# EAGLE design Radio Board Rev B (EAGLE 9.1.1)
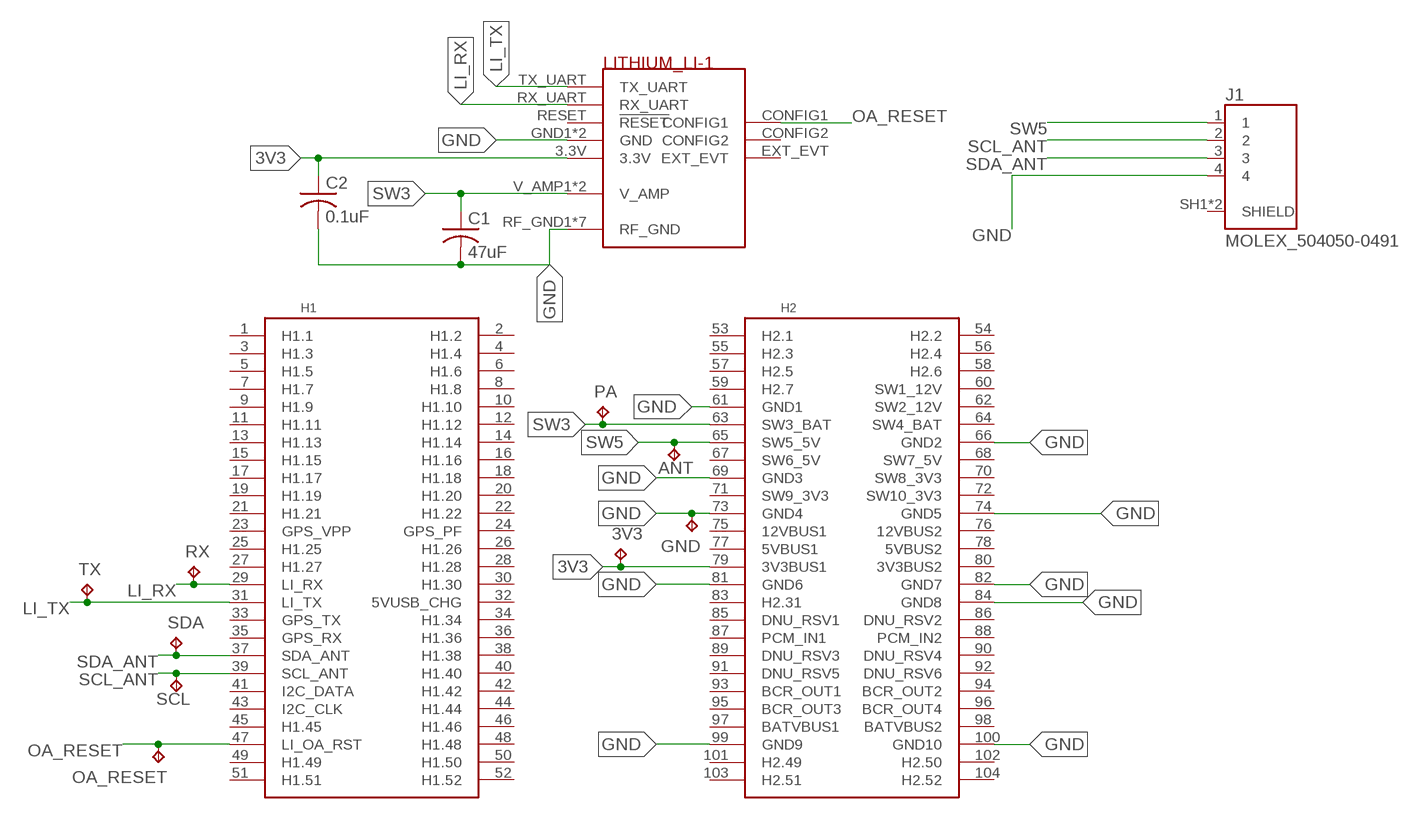
[diagram p0: schematic, sheet 1]

## Parts
3V3  TPTP10SQ  [TP10SQ]
ANT  TPTP10SQ  [TP10SQ]
C1  47uF  C-USC0805  [C0805]
C2  0.1uF  C-USC0805  [C0805]
GND  TPTP10SQ  [TP10SQ]
J1  MOLEX_504050-0491  [MOLEX_5040500491]
LI-1  LI-1  [LI-1]
OA_RESET  TPTP10SQ  [TP10SQ]
PA  TPTP10SQ  [TP10SQ]
RX  TPTP10SQ  [TP10SQ]
SCL  TPTP10SQ  [TP10SQ]
SDA  TPTP10SQ  [TP10SQ]
TX  TPTP10SQ  [TP10SQ]
U$1  PC104_NO_DIMENSION  [PC104_NO_DIMENSION]

## Nets
3V3: 3V3.TP C2.1 LI-1.3.3V U$1.79(3V3BUS1)
GND: C1.2 C2.2 GND.TP J1.4 LI-1.GND1(GND) LI-1.GND2(GND) LI-1.RF_GND1(RF_GND) LI-1.RF_GND2(RF_GND) LI-1.RF_GND3(RF_GND) LI-1.THERM1(RF_GND) LI-1.THERM2(RF_GND) LI-1.THERM3(RF_GND) LI-1.THERM4(RF_GND) U$1.61(GND1) U$1.66(GND2) U$1.69(GND3) U$1.73(GND4) U$1.74(GND5) U$1.81(GND6) U$1.82(GND7) U$1.84(GND8) U$1.99(GND9) U$1.100(GND10)
LI_RX: LI-1.RX_UART RX.TP U$1.29(LI_RX)
LI_TX: LI-1.TX_UART TX.TP U$1.31(LI_TX)
OA_RESET: LI-1.CONFIG1 OA_RESET.TP U$1.47(LI_OA_RST)
SCL_ANT: J1.2 SCL.TP U$1.39(SCL_ANT)
SDA_ANT: J1.3 SDA.TP U$1.37(SDA_ANT)
SW3: C1.1 LI-1.V_AMP1(V_AMP) LI-1.V_AMP2(V_AMP) PA.TP U$1.63(SW3_BAT)
SW5: ANT.TP J1.1 U$1.65(SW5_5V)
Unconnected: LI-1.CONFIG2 LI-1.EXT_EVT LI-1.RESET(!RESET) U$1.1(H1.1) U$1.2(H1.2) U$1.3(H1.3) U$1.4(H1.4) U$1.5(H1.5) U$1.6(H1.6) U$1.7(H1.7) U$1.8(H1.8) U$1.9(H1.9) U$1.10(H1.10) U$1.11(H1.11) U$1.12(H1.12) U$1.13(H1.13) U$1.14(H1.14) U$1.15(H1.15) U$1.16(H1.16) U$1.17(H1.17) U$1.18(H1.18) U$1.19(H1.19) U$1.20(H1.20) U$1.21(H1.21) U$1.22(H1.22) U$1.23(GPS_VPP) U$1.24(GPS_PF) U$1.25(H1.25) U$1.26(H1.26) U$1.27(H1.27) U$1.28(H1.28) U$1.30(H1.30) U$1.32(5VUSB_CHG) U$1.33(GPS_TX) U$1.34(H1.34) U$1.35(GPS_RX) U$1.36(H1.36) U$1.38(H1.38) U$1.40(H1.40) U$1.41(I2C_DATA) U$1.42(H1.42) U$1.43(I2C_CLK) U$1.44(H1.44) U$1.45(H1.45) U$1.46(H1.46) U$1.48(H1.48) U$1.49(H1.49) U$1.50(H1.50) U$1.51(H1.51) U$1.52(H1.52) U$1.53(H2.1) U$1.54(H2.2) U$1.55(H2.3) U$1.56(H2.4) U$1.57(H2.5) U$1.58(H2.6) U$1.59(H2.7) U$1.60(SW1_12V) U$1.62(SW2_12V) U$1.64(SW4_BAT) U$1.67(SW6_5V) U$1.68(SW7_5V) U$1.70(SW8_3V3) U$1.71(SW9_3V3) U$1.72(SW10_3V3) U$1.75(12VBUS1) U$1.76(12VBUS2) U$1.77(5VBUS1) U$1.78(5VBUS2) U$1.80(3V3BUS2) U$1.83(H2.31) U$1.85(DNU_RSV1) U$1.86(DNU_RSV2) U$1.87(PCM_IN1) U$1.88(PCM_IN2) U$1.89(DNU_RSV3) U$1.90(DNU_RSV4) U$1.91(DNU_RSV5) U$1.92(DNU_RSV6) U$1.93(BCR_OUT1) U$1.94(BCR_OUT2) U$1.95(BCR_OUT3) U$1.96(BCR_OUT4) U$1.97(BATVBUS1) U$1.98(BATVBUS2) U$1.101(H2.49) U$1.102(H2.50) U$1.103(H2.51) U$1.104(H2.52)

## Power pins joined to a net without a drawn wire
SHIELD: J1.SH1(SHIELD) J1.SH2(SHIELD)

## Library data of the parts
3V3 ANT GND OA_RESET PA RX SCL SDA TX = testpad:TP: Test pad
C1 C2 = resistor:C-US: CAPACITOR, American symbol
J1 = Molex 504050-0491:MOLEX_504050-0491: Conn Wire to Board HDR 4 POS 1.5mm Solder RA SMD Pico-Lock; AVAILABILITY: Good; DESCRIPTION: Conn Wire to Board HDR 4 POS 1.5mm Solder RA SMD Pico-Lock; MF: Molex; MP: 5040500491; PACKAGE: None
LI-1 = Cubesat:LI-1
U$1 = Cubesat:PC104_NO_DIMENSION

## Board
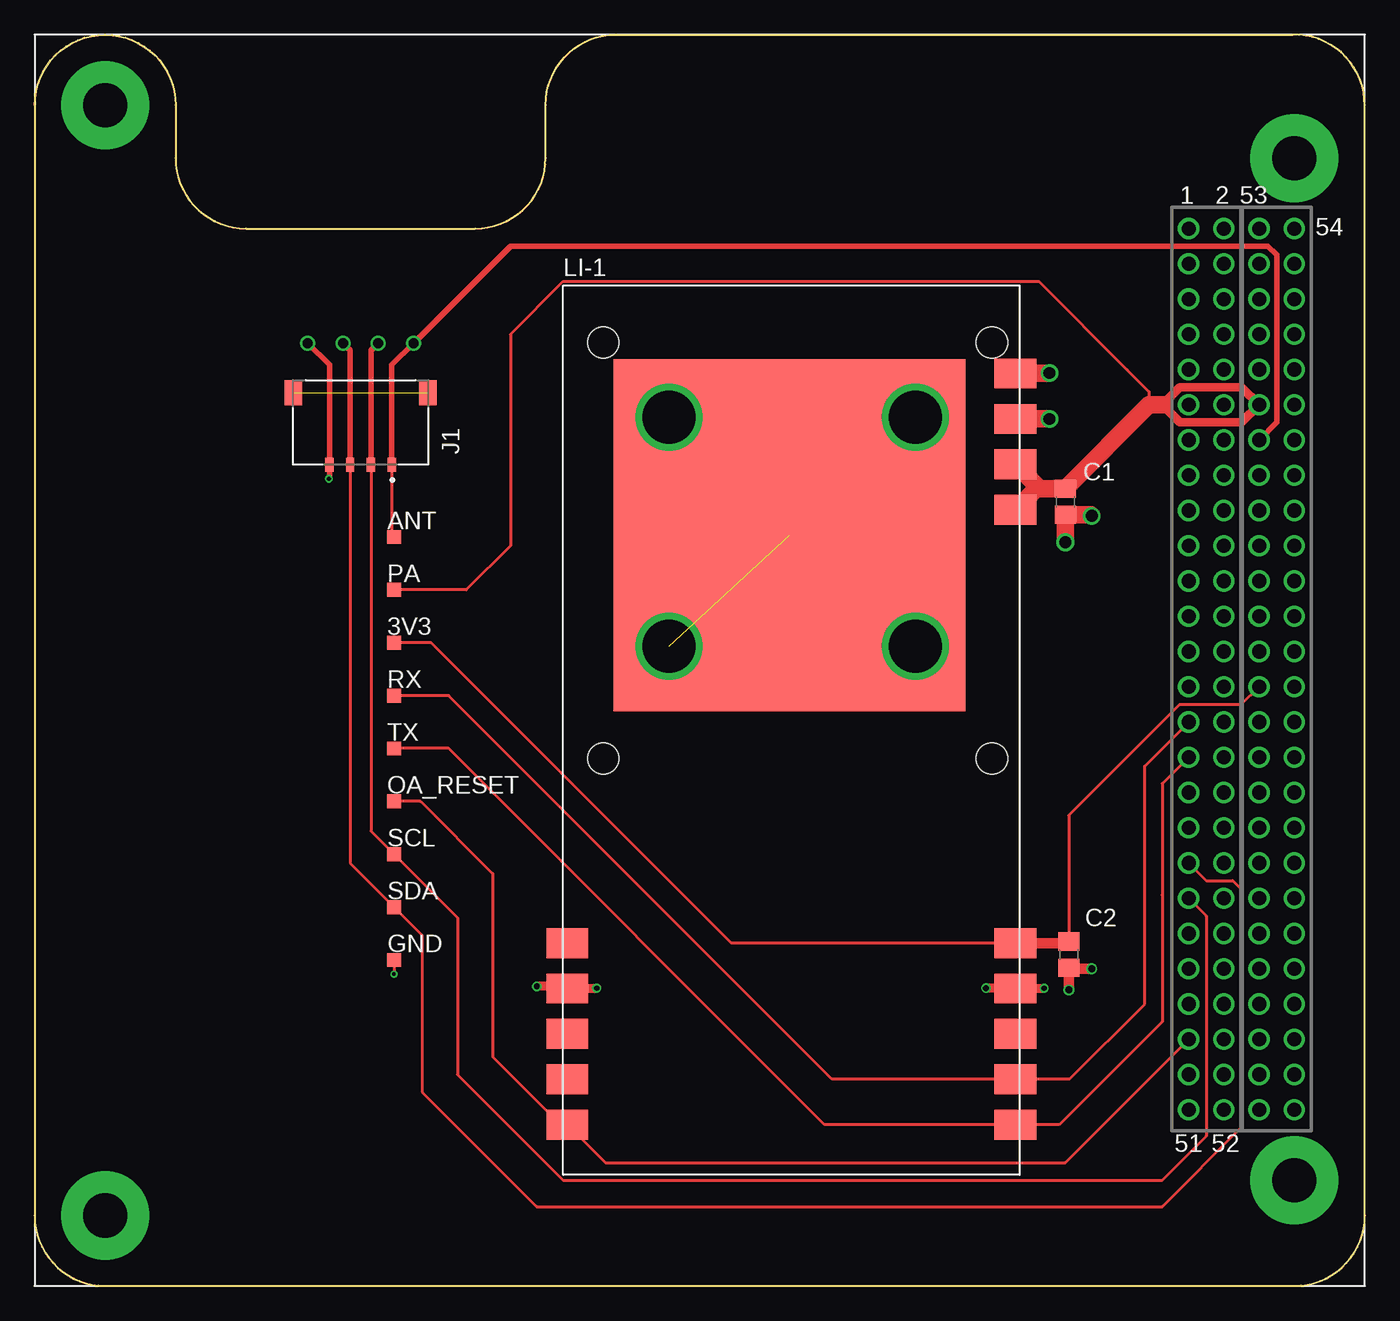
[diagram p1: board, top side]
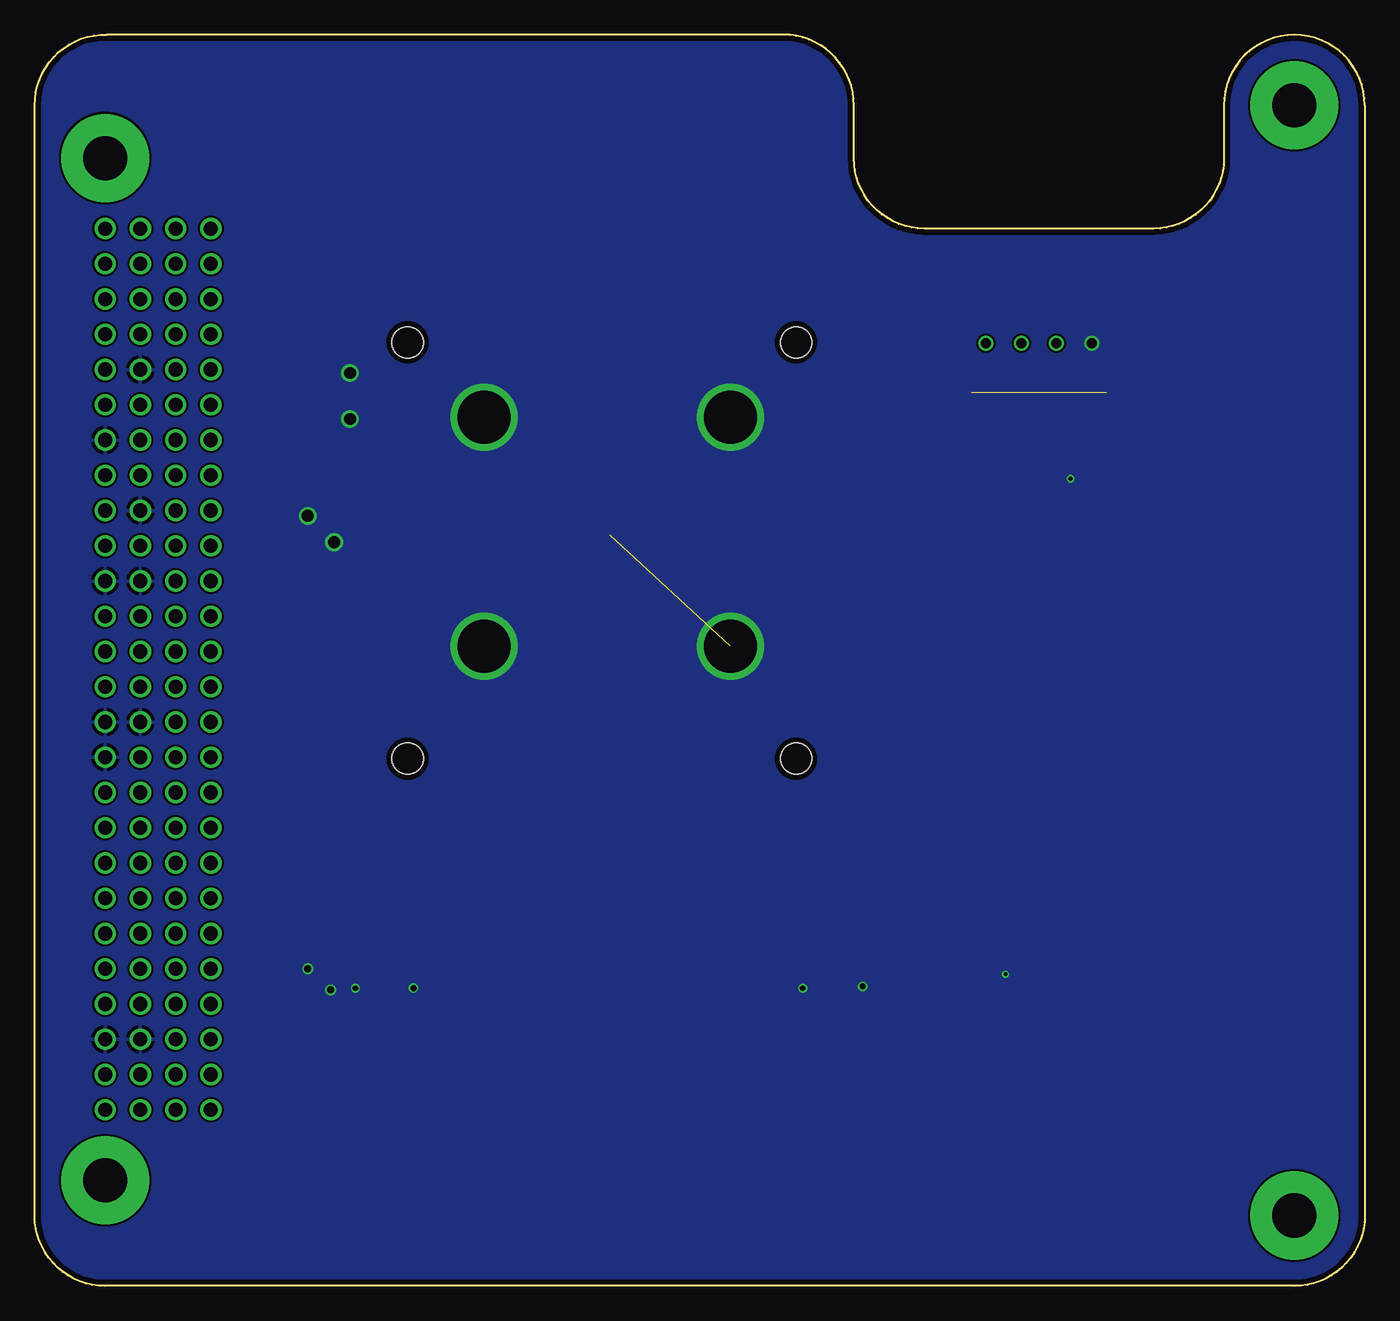
[diagram p2: board, bottom side, seen from below]

Size 95.89 x 90.17 mm. Coordinates in mm from the lower left corner, seen from the top.
Outline: 0,85.09 0,5.08 arc90 5.08,0 90.81,0 arc90 95.89,5.08 95.89,85.09 arc91 90.68,90.17 41.91,90.17 arc90 36.83,85.09 36.83,81.28 arc-90 31.75,76.2 15.24,76.2 arc-90 10.16,81.28 10.16,85.09 arc180 0,85.09
Copper layers (1*16): Top 0.035559375mm / dielectric 1.6mm / Bottom 0.035559375mm
Design rules "oshpark-2layer": minimum track width 6mil, minimum drill 10mil, track to track 6mil, track to pad 6mil, pad to pad 6mil, via to via 6mil, smd to smd 6mil, copper to edge 15mil, drill to drill 6mil, minimum pad ring 5mil, minimum via ring 5mil, stop-mask expansion 2.5mil, vias tented up to drill 0mil, thermal gap 10mil

### Footprints (pad centres in the part's own frame; a part is rotated, then mirrored left to right if it is on the bottom)
TP10SQ = smd 1 x 1: TP 0,0
C0805 = smd 1.3 x 1.5: 1 -0.95,0; 2 0.95,0
MOLEX_5040500491 = smd 0.6 x 1: 1 -2.25,3.04; 2 -0.75,3.04; 3 0.75,3.04; 4 2.25,3.04 | smd 1.25 x 1.8: SH1 4.855,-2.15; SH2 -4.855,-2.15
LI-1 = smd 3 x 2.15: 3.3V 32.6,16.71; CONFIG1 0.3,3.63; CONFIG2 0.3,6.9; EXT_EVT 0.3,10.17; GND1 0.3,13.44; GND2 32.6,13.44; NC 0.3,16.71; RESET 32.6,10.17; RF_GND1 32.6,54.48; RF_GND2 32.6,57.75; RX_UART 32.6,6.9; TX_UART 32.6,3.63; V_AMP1 32.6,47.94; V_AMP2 32.6,51.21 | smd 25.35 x 25.35: RF_GND3 16.3,46.1 | drill 3.81: THERM1 7.62,54.61; THERM2 25.4,54.61; THERM3 25.4,38.1; THERM4 7.62,38.1 | hole 2.25: 2.9,60; 2.9,30; 30.9,60; 30.9,30
PC104_NO_DIMENSION = drill 1.016 pad 1.524: 1 83.185,76.2; 2 85.725,76.2; 3 83.185,73.66; 4 85.725,73.66; 5 83.185,71.12; 6 85.725,71.12; 7 83.185,68.58; 8 85.725,68.58; 9 83.185,66.04; 10 85.725,66.04; 11 83.185,63.5; 12 85.725,63.5; 13 83.185,60.96; 14 85.725,60.96; 15 83.185,58.42; 16 85.725,58.42; 17 83.185,55.88; 18 85.725,55.88; 19 83.185,53.34; 20 85.725,53.34; 21 83.185,50.8; 22 85.725,50.8; 23 83.185,48.26; 24 85.725,48.26; 25 83.185,45.72; 26 85.725,45.72; 27 83.185,43.18; 28 85.725,43.18; 29 83.185,40.64; 30 85.725,40.64; 31 83.185,38.1; 32 85.725,38.1; 33 83.185,35.56; 34 85.725,35.56; 35 83.185,33.02; 36 85.725,33.02; 37 83.185,30.48; 38 85.725,30.48; 39 83.185,27.94; 40 85.725,27.94; 41 83.185,25.4; 42 85.725,25.4; 43 83.185,22.86; 44 85.725,22.86; 45 83.185,20.32; 46 85.725,20.32; 47 83.185,17.78; 48 85.725,17.78; 49 83.185,15.24; 50 85.725,15.24; 51 83.185,12.7; 52 85.725,12.7; 53 88.265,76.2; 54 90.805,76.2; 55 88.265,73.66; 56 90.805,73.66; 57 88.265,71.12; 58 90.805,71.12; 59 88.265,68.58; 60 90.805,68.58; 61 88.265,66.04; 62 90.805,66.04; 63 88.265,63.5; 64 90.805,63.5; 65 88.265,60.96; 66 90.805,60.96; 67 88.265,58.42; 68 90.805,58.42; 69 88.265,55.88; 70 90.805,55.88; 71 88.265,53.34; 72 90.805,53.34; 73 88.265,50.8; 74 90.805,50.8; 75 88.265,48.26; 76 90.805,48.26; 77 88.265,45.72; 78 90.805,45.72; 79 88.265,43.18; 80 90.805,43.18; 81 88.265,40.64; 82 90.805,40.64; 83 88.265,38.1; 84 90.805,38.1; 85 88.265,35.56; 86 90.805,35.56; 87 88.265,33.02; 88 90.805,33.02; 89 88.265,30.48; 90 90.805,30.48; 91 88.265,27.94; 92 90.805,27.94; 93 88.265,25.4; 94 90.805,25.4; 95 88.265,22.86; 96 90.805,22.86; 97 88.265,20.32; 98 90.805,20.32; 99 88.265,17.78; 100 90.805,17.78; 101 88.265,15.24; 102 90.805,15.24; 103 88.265,12.7; 104 90.805,12.7 | drill 3.175 pad 6.35: MNT1 5.08,85.09; MNT2 5.08,5.08; MNT3 90.805,81.28; MNT4 90.805,7.62

### Placement (x,y rotation side)
3V3  25.91,46.35 0 top
ANT  25.91,53.98 0 top
C1  74.3,56.52 270 top
C2  74.55,23.88 270 top
GND  25.91,23.5 0 top
J1  23.5,62.23 180 top
LI-1  38.1,8 0 top
OA_RESET  25.91,34.92 0 top
PA  25.91,50.16 0 top
RX  25.91,42.55 0 top
SCL  25.91,31.11 0 top
SDA  25.91,27.3 0 top
TX  25.91,38.73 0 top
U$1  0,0 0 top

### Tracks (layer width: path | path; a pad name or v marks a point on that pad's centre or on a via)
3V3
  Top 0.203: C2.1 74.55,33.91 82.55,41.91 87,41.91 U$1.79 | LI-1.3.3V 50.22,24.71 28.57,46.35 3V3.TP
  Top 0.762: LI-1.3.3V 74.43,24.71 C2.1
GND  (via drill 0.25, 0.3, 0.38, 0.42, 0.51, 0.71, 0.85)  (1 unrouted)
  Top 0.203: GND.TP v25.91,22.48
  Top 0.406: v19.68,67.94 21.25,66.39 J1.4 21.25,58.2 v21.21,58.17
  Top 0.635: v40.51,21.46 40.49,21.44 LI-1.GND1 38.25,21.59 v36.2,21.59 | v72.77,21.46 72.75,21.44 LI-1.GND2 68.6,21.44 v68.58,21.46
  Top 0.762: v74.55,21.34 C2.2 74.61,22.86 v76.2,22.86
  Top 1.27: v74.3,53.59 C1.2 76.13,55.56 v76.2,55.5 | LI-1.RF_GND1 v73.15,62.48 | LI-1.RF_GND2 70.74,65.79 v73.15,65.79
  pour Bottom: 0,90.17 95.89,90.17 95.89,0 0,0
LI_RX
  Top 0.203: U$1.29 80.01,37.47 80.01,20.32 74.59,14.9 LI-1.RX_UART 57.49,14.9 29.84,42.55 RX.TP
LI_TX
  Top 0.203: 81.28,28.18 81.28,36.2 U$1.31 | 81.28,28.18 | 81.28,28.18 81.28,19.05 73.86,11.63 LI-1.TX_UART 56.95,11.63 29.84,38.73 TX.TP
OA_RESET
  Top 0.203: U$1.47 74.3,8.89 41.14,8.89 LI-1.CONFIG1 37.9,11.63 33.02,16.51 33.02,29.72 27.81,34.92 OA_RESET.TP
SCL_ANT  (via drill 0.71)
  Top 0.203: U$1.39 84.14,26.99 84.45,26.67 84.45,10.79 81.28,7.62 38.1,7.62 30.48,15.24 30.48,26.54 SCL.TP 24.25,32.78 J1.2
  Top 0.406: J1.2 24.25,67.42 v24.77,67.94
SDA_ANT  (via drill 0.71)
  Top 0.203: U$1.37 84.45,29.21 86.36,29.21 87,28.57 87,11.43 81.28,5.71 36.2,5.71 27.94,13.97 27.94,25.27 SDA.TP 22.75,30.47 J1.3
  Top 0.406: J1.3 22.75,67.42 v22.23,67.94
SHIELD  (1 unrouted)
SW3
  Top 0.203: PA.TP 31.11,50.16 34.29,53.34 34.29,68.58 38.1,72.39 72.39,72.39 78.74,66.04 | 78.74,66.04 | 78.74,66.04 80.33,64.45 80.33,63.5
  Top 0.61: 81.28,63.5 82.55,64.77 87,64.77 U$1.63 87,62.23 82.55,62.23 81.28,63.5
  Top 1.27: 72.44,57.47 C1.1 80.33,63.5 81.28,63.5 | 72.44,57.47 LI-1.V_AMP2 | LI-1.V_AMP1 72.22,57.47 72.44,57.47
SW5  (via drill 0.71)
  Top 0.203: J1.1 25.75,54.14 ANT.TP
  Top 0.406: U$1.65 89.53,62.23 89.53,74.3 88.9,74.93 34.29,74.93 v27.3,67.94 25.75,66.39 J1.1